# Altium schematic sheet Connectors.SchDoc
size A4; DrawnBy: sht4; DocumentCode: Децимальный номер; SchemeType: Схема электрическая принципиальная; PageSetup: Record=PageOptionsZCenterHorizontal=TrueZCenterVertical=TrueZPrintScale=0.95ZXCorrection=1.00ZYCorrection=1.00ZPrintKind=2ZBorderSize=5000000ZLeftOffset=0ZBottomOffset=0ZOrientation=1ZPaperLength=1000ZPaperWidth=1000ZScale=100ZPaperSource=7ZPrintQuality=600ZMediaType=1ZDitherType=10ZPaperKind=A4 (210 x 297 мм)ZPrintScaleMode=1; Rule: PcbType=ProtelPcb; Rule: UNIONINDEX{}0[]RULEKIND{}Clearance[]NETSCOPE{}DifferentNets[]LAYERKIND{}SameLayer[]NAME{}Schematic Clearance Constraint[]GAP{}10mil[]GENERICCLEARANCE{}10mil[]IGNOREPADTOPADCLEARANCEINFOOTPRINT{}FALSE[]OBJECTCLEARANCES{}ClearanceObj_Arc-ClearanceObj_Hole:0;ClearanceObj_Track-ClearanceObj_Hole:0;ClearanceObj_SMDPad-ClearanceObj_Hole:0;ClearanceObj_THPad-ClearanceObj_Hole:0;ClearanceObj_Via-ClearanceObj_Hole:0;ClearanceObj_Fill-ClearanceObj_Hole:0;ClearanceObj_Poly-ClearanceObj_Hole:0;ClearanceObj_Region-ClearanceObj_Hole:0;ClearanceObj_Text-ClearanceObj_Hole:0[]UNIT{}Metric[]PcbType{}ProtelPcb
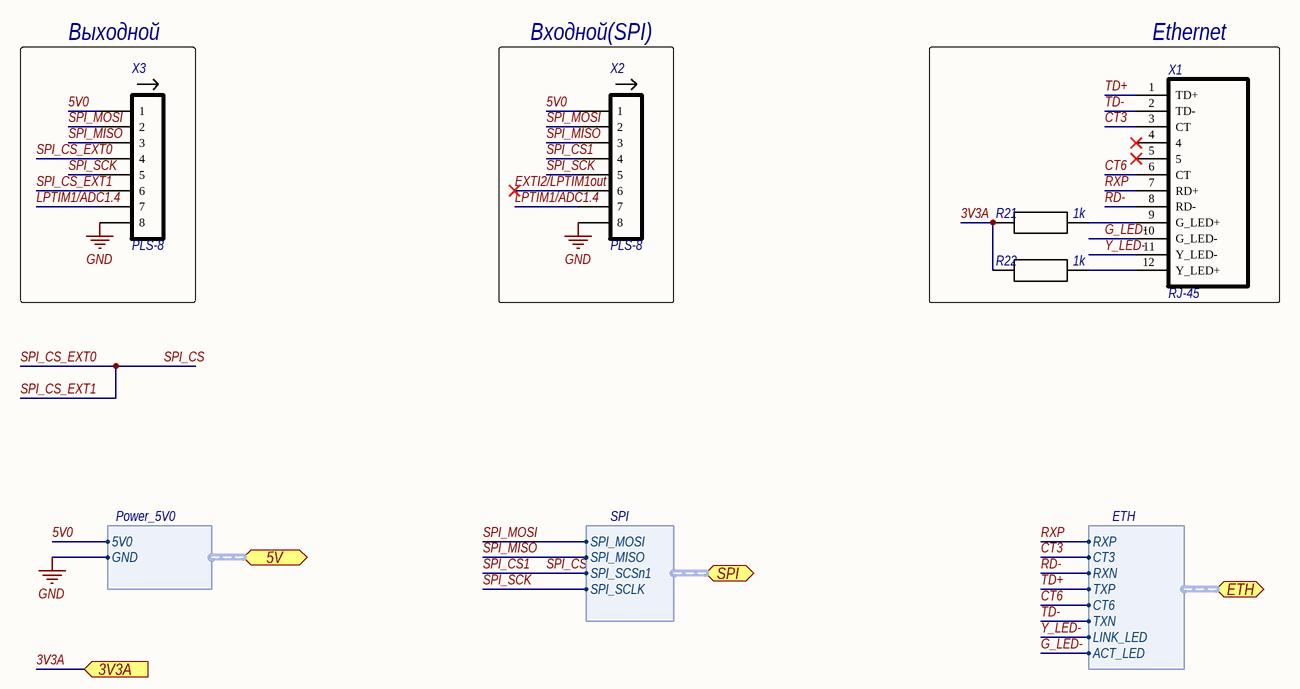
[diagram p0: Connectors.SchDoc]

## Parts
R21  1k
R22  1k
X1  RJ-45
X2  PLS-8  [B8B-PH-K-S(LF)(SN)]
X3  PLS-8  [B8B-PH-K-S(LF)(SN)]

## Blocks framed on the sheet
Выходной: X3
Входной(SPI): X2
Ethernet: R21 R22 X1

## Ports
3V3A, 5V (harness Power_5V0), ETH (harness ETH), SPI (harness SPI)

## Harnesses
ETH: RXP, RXN, TXP, TXN, CT3, CT6, ACT_LED, LINK_LED
SPI: SPI_MOSI, SPI_MISO, SPI_SCSn1, SPI_SCLK
Power_5V0: 5V0, GND

## Nets
GND: X2.8 X3.8 ; port 5V.GND
3V3A: R21.2 R22.2 ; port 3V3A
5V0: X2.1 X3.1 ; port 5V.5V0
CT3: X1.3(CT) ; port ETH.CT3
CT6: X1.6(CT) ; port ETH.CT6
EXTI2/LPTIM1out: X2.6
G_LED-: X1.10(G_LED-) ; port ETH.ACT_LED
LPTIM1/ADC1.4: X2.7 X3.7
RD-: X1.8(RD-) ; port ETH.RXN
RXP: X1.7(RD+) ; port ETH.RXP
SPI_CS: X2.4 X3.4 X3.6 ; port SPI.SPI_SCSn1  [also labelled SPI_CS1, SPI_CS_EXT0, SPI_CS_EXT1]
SPI_MISO: X2.3 X3.3 ; port SPI.SPI_MISO
SPI_MOSI: X2.2 X3.2 ; port SPI.SPI_MOSI
SPI_SCK: X2.5 X3.5 ; port SPI.SPI_SCLK
TD+: X1.1(TD+) ; port ETH.TXP
TD-: X1.2(TD-) ; port ETH.TXN
Y_LED-: X1.11(Y_LED-) ; port ETH.LINK_LED
NetR21_1: R21.1 X1.9(G_LED+)
NetR22_1: R22.1 X1.12(Y_LED+)

Not connected (* = marked no-connect by the designer): X1 4* 5*

## Notes on the sheet
- Title
- Size:
- Date:
- A4
- Number:
- Time:
- Revision:
- Sheet
- of
- File:

## Library data of the parts
R21 R22 = Resistor
X2 X3 = 8-pin plug